# EAGLE design MIC_module (EAGLE 7.2.0)
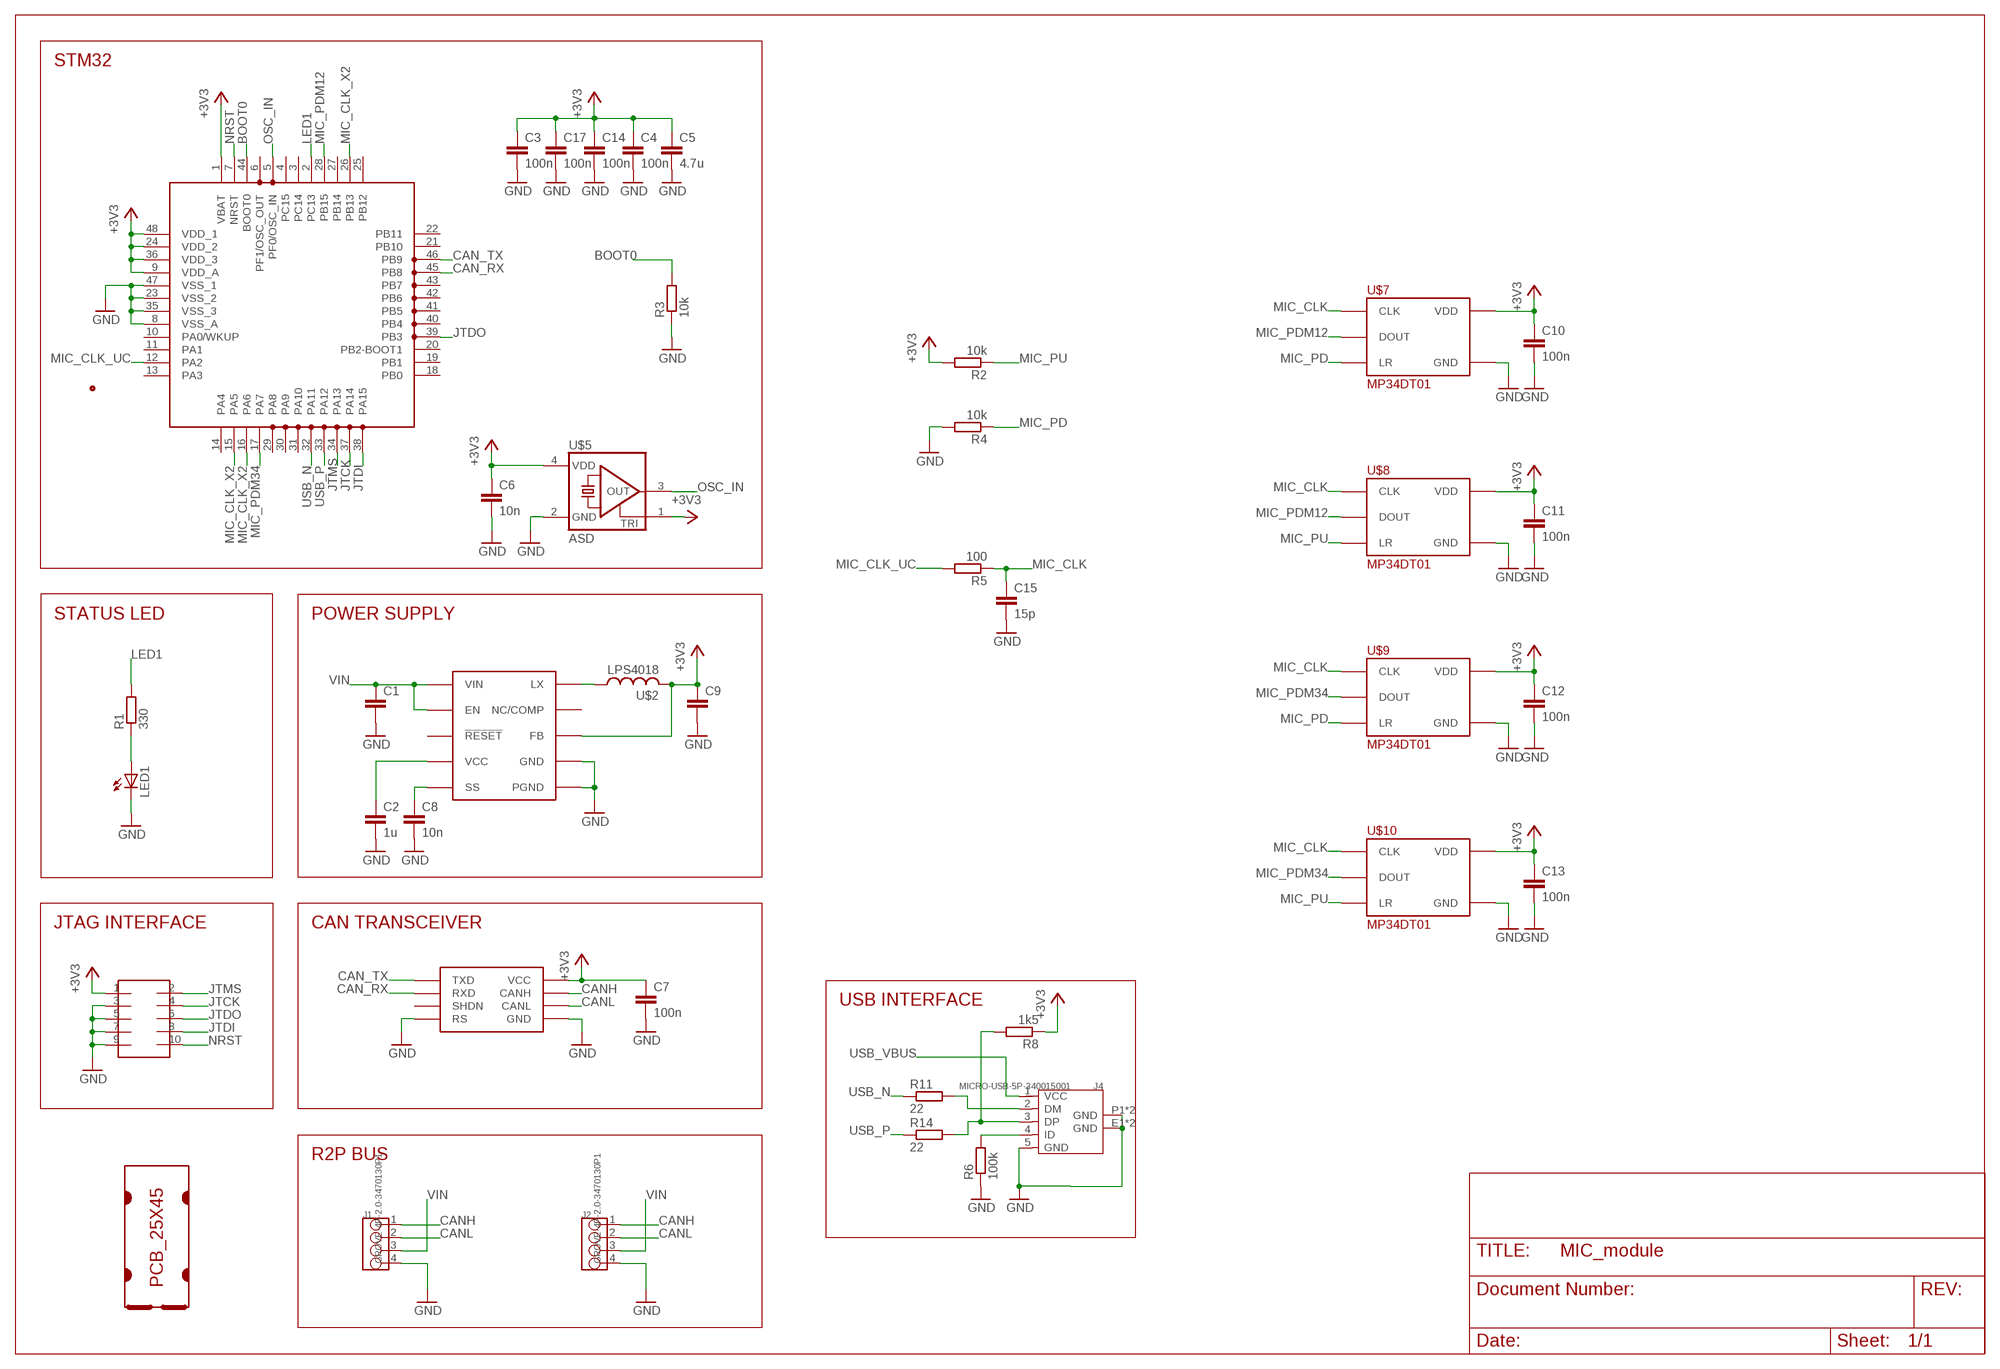
[diagram p0: schematic, sheet 1]

## Parts
C1  C-EUC1206  [C1206]
C2  1u  C-EUC0603  [C0603]
C3  100n  C-EUC0603  [C0603]
C4  100n  C-EUC0603  [C0603]
C5  4.7u  C-EUC0805  [C0805]
C6  10n  C-EUC0603  [C0603]
C7  100n  C-EUC0603  [C0603]
C8  10n  C-EUC0603  [C0603]
C9  C-EUC0805  [C0805]
C10  100n  C-EUC0603  [C0603]
C11  100n  C-EUC0603  [C0603]
C12  100n  C-EUC0603  [C0603]
C13  100n  C-EUC0603  [C0603]
C14  100n  C-EUC0603  [C0603]
C15  15p  C-EUC0603  [C0603]
C17  100n  C-EUC0603  [C0603]
J1  GROVE-4P-2.0-3470130P1  [4P-2.0]
J2  GROVE-4P-2.0-3470130P1  [4P-2.0]
J4  MICRO-USB-5P-340015001  [B-SMD-5P]
LED1  LEDCHIPLED_0805  [CHIPLED_0805]
R1  330  R-EU_R0603  [R0603]
R2  10k  R-EU_R0603  [R0603]
R3  10k  R-EU_R0603  [R0603]
R4  10k  R-EU_R0603  [R0603]
R5  100  R-EU_R0603  [R0603]
R6  100k  R-EU_R0603  [R0603]
R8  1k5  R-EU_R0603  [R0603]
R11  22  R-EU_R0603  [R0603]
R14  22  R-EU_R0603  [R0603]
SOT1  MAX3051EKA  [SOT23-8L]
U$1  PCB_25X45  [25X45]
U$2  LPS4018  [LPS4018]
U$3  MAX17501  [TDFN-10]
U$4  FTSH-105TH  [FTSH-105-TH]
U$5  ASD  [2.5X2]
U$6  STM32F303C  [LQFP48]
U$7  MP34DT01  [MP34DT01]
U$8  MP34DT01  [MP34DT01]
U$9  MP34DT01  [MP34DT01]
U$10  MP34DT01  [MP34DT01]

## Nets
+3V3: C3.1 C4.1 C5.1 C6.1 C7.1 C9.1 C10.1 C11.1 C12.1 C13.1 C14.1 C17.1 R2.2 R8.1 SOT1.3(VCC) U$2.P$2 U$3.P$5(FB) U$4.1 U$5.1(TRI) U$5.4(VDD) U$6.1(VBAT) U$6.9(VDD_A) U$6.24(VDD_2) U$6.36(VDD_3) U$6.48(VDD_1) U$7.P$1(VDD) U$8.P$1(VDD) U$9.P$1(VDD) U$10.P$1(VDD)
BOOT0: R3.2 U$6.44(BOOT0)
CAN_RX: SOT1.4(RXD) U$6.45(PB8)
CAN_TX: SOT1.1(TXD) U$6.46(PB9)
CANH: J1.1 J2.1 SOT1.7(CANH)
CANL: J1.2 J2.2 SOT1.6(CANL)
GND: C1.2 C2.2 C3.2 C4.2 C5.2 C6.2 C7.2 C8.2 C9.2 C10.2 C11.2 C12.2 C13.2 C14.2 C15.2 C17.2 J1.4 J2.4 J4.5(GND) J4.E1(GND) J4.E2(GND) J4.P1(GND) J4.P2(GND) LED1.C R3.1 R4.2 R6.1 SOT1.2(GND) SOT1.8(RS) U$3.P$1(PGND) U$3.P$9(GND) U$3.P$11(PGND) U$4.3 U$4.5 U$4.7 U$4.9 U$5.2(GND) U$6.8(VSS_A) U$6.23(VSS_2) U$6.35(VSS_3) U$6.47(VSS_1) U$7.P$5(GND) U$7.P$6(GND) U$7.P$7(GND) U$7.P$8(GND) U$8.P$5(GND) U$8.P$6(GND) U$8.P$7(GND) U$8.P$8(GND) U$9.P$5(GND) U$9.P$6(GND) U$9.P$7(GND) U$9.P$8(GND) U$10.P$5(GND) U$10.P$6(GND) U$10.P$7(GND) U$10.P$8(GND)
JTCK: U$4.4 U$6.37(PA14)
JTDI: U$4.8 U$6.38(PA15)
JTDO: U$4.6 U$6.39(PB3)
JTMS: U$4.2 U$6.34(PA13)
LED1: R1.2 U$6.2(PC13)
MIC_CLK: C15.1 R5.1 U$7.P$3(CLK) U$8.P$3(CLK) U$9.P$3(CLK) U$10.P$3(CLK)
MIC_CLK_UC: R5.2 U$6.12(PA2)
MIC_CLK_X2: U$6.15(PA5) U$6.16(PA6) U$6.26(PB13)
MIC_PD: R4.1 U$7.P$2(LR) U$9.P$2(LR)
MIC_PDM12: U$6.28(PB15) U$7.P$4(DOUT) U$8.P$4(DOUT)
MIC_PDM34: U$6.17(PA7) U$9.P$4(DOUT) U$10.P$4(DOUT)
MIC_PU: R2.1 U$8.P$2(LR) U$10.P$2(LR)
N$1: U$2.P$1 U$3.P$10(LX)
N$3: J4.2(DM) R11.2
N$4: LED1.A R1.1
N$5: J4.4(ID) R6.2
N$7: C2.1 U$3.P$4(VCC)
N$8: C8.1 U$3.P$6(SS)
N$32: J4.3(DP) R8.2 R14.2
NRST: U$4.10 U$6.7(NRST)
OSC_IN: U$5.3(OUT) U$6.5(PF0/OSC_IN)
USB_N: R11.1 U$6.32(PA11)
USB_P: R14.1 U$6.33(PA12)
USB_VBUS: J4.1(VCC)
VIN: C1.1 J1.3 J2.3 U$3.P$2(VIN) U$3.P$3(EN)
Unconnected: SOT1.5(SHDN) U$3.P$7(NC/COMP) U$3.P$8(!RESET) U$6.3(PC14) U$6.4(PC15) U$6.6(PF1/OSC_OUT) U$6.10(PA0/WKUP) U$6.11(PA1) U$6.13(PA3) U$6.14(PA4) U$6.18(PB0) U$6.19(PB1) U$6.20(PB2-BOOT1) U$6.21(PB10) U$6.22(PB11) U$6.25(PB12) U$6.27(PB14) U$6.29(PA8) U$6.30(PA9) U$6.31(PA10) U$6.40(PB4) U$6.41(PB5) U$6.42(PB6) U$6.43(PB7)

## Notes on the sheet
- STM32
- STATUS LED | POWER SUPPLY
- JTAG INTERFACE | CAN TRANSCEIVER
- USB INTERFACE
- R2P BUS

## Library data of the parts
C1-C15 C17 = rcl:C-EU: CAPACITOR, European symbol
J1 J2 = OPL Eagle Library:GROVE-4P-2.0
J4 = OPL Eagle Library:MICRO-USB-5P: ST-USB-001E：MICRO USB B SMD R/A
LED1 = led:LED: LED OSRAM: - CHIPLED LG R971, LG N971, LY N971, LG Q971, LY Q971, LO R971, LY R971 LH N974, LH R974 LS Q976, LO Q976, LY Q976 LO Q996 - Hyper CHIPLED LW Q18S LB Q993, LB Q99A, LB R99A - SideLED LS A670, LO A670, LY A670, LG A670, LP A670 LB A673, LV A673, LT A673, LW A673 LH A674 LY A675 LS A676, LA A676, LO A676, LY A676, LW A676 LS A679, LY A679, LG A679 - Hyper Micro SIDELED® LS Y876, LA Y876, LO Y876, LY Y876 LT Y87S - SmartLED LW L88C, LW L88S LB L89C, LB L89S, LG L890 LS L89K, LO L89K, LY L89K LS L896, LA L896, LO L896, LY L896 - TOPLED LS T670, LO T670, LY T670, LG T670, LP T670 LSG T670, LSP T670, LSY T670, LOP T670, LYG T670 LG T671, LOG T671, LSG T671 LB T673, LV T673, LT T673, LW T673 LH T674 LS T676, LA T676, LO T676, LY T676, LB T676, LH T676, LSB T676, LW T676 LB T67C, LV T67C, LT T67C, LS T67K, LO T67K, LY T67K, LW E67C LS E67B, LA E67B, LO E67B, LY E67B, LB E67C, LV E67C, LT E67C LW T67C LS T679, LY T679, LG T679 LS T770, LO T770, LY T770, LG T770, LP T770 LB T773, LV T773, LT T773, LW T773 LH T774 LS E675, LA E675, LY E675, LS T675 LS T776, LA T776, LO T776, LY T776, LB T776 LHGB T686 LT T68C, LB T68C - Hyper Mini TOPLED® LB M676 - Mini TOPLED Santana® LG M470 LS M47K, LO M47K, LY M47K Source: http://www.osram.convergy.de LUXEON: - LUMILED® LXK2-PW12-R00, LXK2-PW12-S00, LXK2-PW14-U00, LXK2-PW14-V00 LXK2-PM12-R00, LXK2-PM12-S00, LXK2-PM14-U00 LXK2-PE12-Q00, LXK2-PE12-R00, LXK2-PE12-S00, LXK2-PE14-T00, LXK2-PE14-U00 LXK2-PB12-K00, LXK2-PB12-L00, LXK2-PB12-M00, LXK2-PB14-N00, LXK2-PB14-P00, LXK2-PB14-Q00 LXK2-PR12-L00, LXK2-PR12-M00, LXK2-PR14-Q00, LXK2-PR14-R00 LXK2-PD12-Q00, LXK2-PD12-R00, LXK2-PD12-S00 LXK2-PH12-R00, LXK2-PH12-S00 LXK2-PL12-P00, LXK2-PL12-Q00, LXK2-PL12-R00 Source: www.luxeon.com KINGBRIGHT: KA-3528ASYC Source: www.kingbright.com
R1-R6 R8 R11 R14 = rcl:R-EU_: RESISTOR, European symbol
SOT1 = maxim:MAX3051
U$1 = r2p_pcb:PCB_25X45
U$2 = coilcraft:LPS4018
U$3 = maxim:MAX17501
U$4 = samtec:FTSH-105
U$5 = abracon:ASD
U$6 = st:STM32F303C
U$7-U$10 = st:MP34DT01

## Board
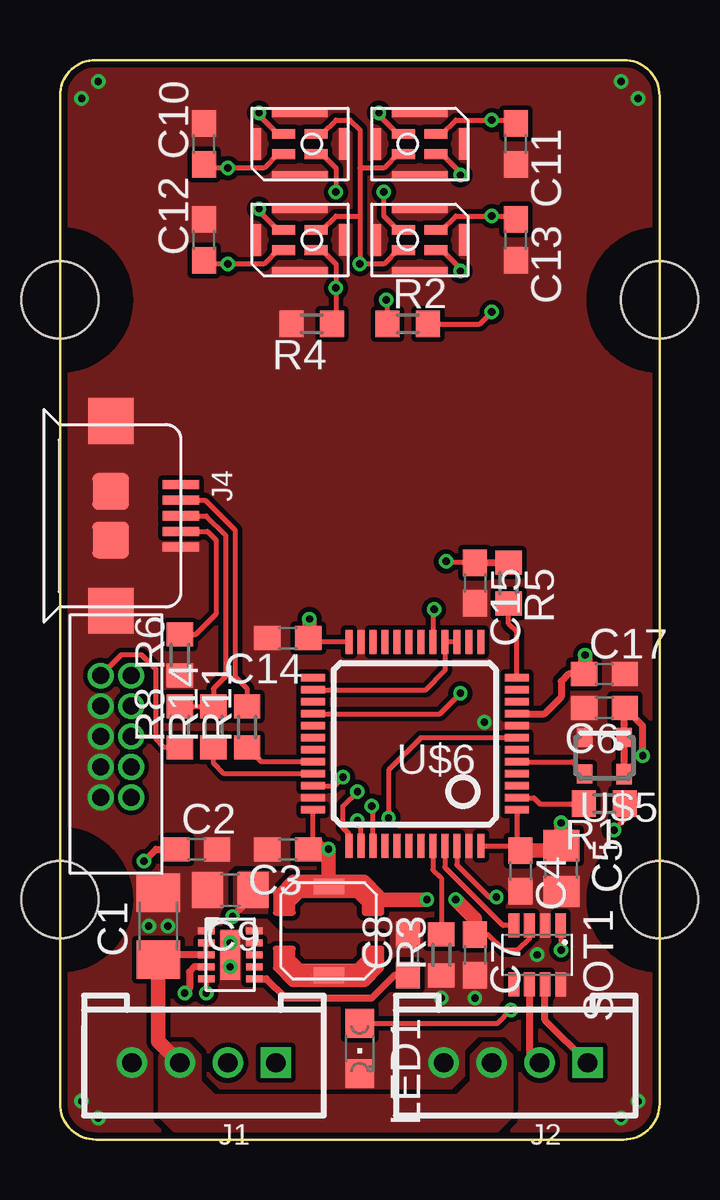
[diagram p1: board, top side]
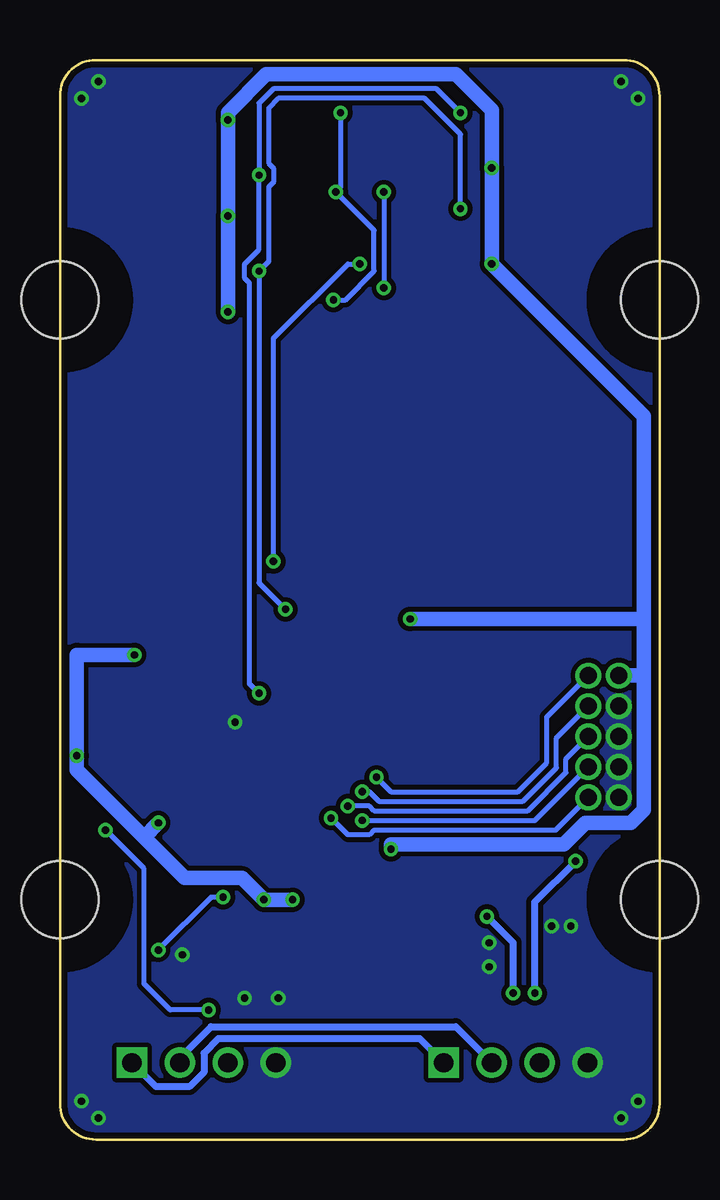
[diagram p2: board, bottom side, seen from below]

Size 25 x 45 mm. Coordinates in mm from the lower left corner, seen from the top.
Copper layers (1*16): Top 0.035mm / dielectric 1.5mm / Bottom 0.035mm
Design rules "test": minimum track width 0.2mm, minimum drill 0.3mm, track to track 0.2mm, track to pad 0.2mm, pad to pad 0.2mm, via to via 0.2mm, smd to smd 0mil, copper to edge 10mil, drill to drill 10mil, minimum pad ring 0.15mm, minimum via ring 0.15mm, stop-mask expansion 2mil, vias tented up to drill 100mil, thermal gap 10mil
tRestrict: 2 lines

### Footprints (pad centres in the part's own frame; a part is rotated, then mirrored left to right if it is on the bottom)
C1206 = smd 1.6 x 1.8: 1 -1.4,0; 2 1.4,0
C0603 = smd 1.1 x 1: 1 -0.85,0; 2 0.85,0
C0805 = smd 1.3 x 1.5: 1 -0.95,0; 2 0.95,0
4P-2.0 = drill 0.8 pad 1.27 square: 1 -3,0 | drill 0.8 pad 1.27: 2 -1,0; 3 1,0; 4 3,0
B-SMD-5P = smd 0.38 x 1.52: 1 -1.3,2.54; 2 -0.65,2.54; 3 0,2.54; 4 0.65,2.54; 5 1.3,2.54 | smd 1.524 x 1.524: E1 -1.016,-0.381; E2 1.016,-0.381 | smd 1.9 x 1.9: P1 -3.95,-0.381; P2 3.95,-0.381
CHIPLED_0805 = smd 1.2 x 1.2: A 0,-1.05; C 0,1.05
R0603 = smd 1 x 1.1: 1 -0.85,0; 2 0.85,0
SOT23-8L = smd 0.45 x 1: 1 -0.975,-1.225; 2 -0.325,-1.225; 3 0.325,-1.225; 4 0.975,-1.225; 5 0.975,1.225; 6 0.325,1.225; 7 -0.325,1.225; 8 -0.975,1.225
25X45 = hole 3.2: 0,10; 25,10; 0,35; 25,35
LPS4018 = smd 0.635 x 1.27: P$1 -1.85,0; P$2 1.85,0
TDFN-10 = smd 0.7 x 0.3: P$1 -1,1; P$2 -1,0.5; P$3 -1,0; P$4 -1,-0.5; P$5 -1,-1; P$6 1,-1; P$7 1,-0.5; P$8 1,0; P$9 1,0.5; P$10 1,1 | smd 0.8 x 2.08: P$11 0,0
FTSH-105-TH = drill 0.711 pad 1.016: 1 -2.54,0; 2 -2.54,1.27; 3 -1.27,0; 4 -1.27,1.27; 5 0,0; 6 0,1.27; 7 1.27,0; 8 1.27,1.27; 9 2.54,0; 10 2.54,1.27
2.5X2 = smd 0.65 x 0.8: 1 -0.825,-0.762; 2 0.825,-0.762; 3 0.825,0.762 | smd 0.65 x 0.85: 4 -0.825,0.762
LQFP48 = smd 1 x 0.3: 1 -4.25,2.75; 2 -4.25,2.25; 3 -4.25,1.75; 4 -4.25,1.25; 5 -4.25,0.75; 6 -4.25,0.25; 7 -4.25,-0.25; 8 -4.25,-0.75; 9 -4.25,-1.25; 10 -4.25,-1.75; 11 -4.25,-2.25; 12 -4.25,-2.75; 25 4.25,-2.75; 26 4.25,-2.25; 27 4.25,-1.75; 28 4.25,-1.25; 29 4.25,-0.75; 30 4.25,-0.25; 31 4.25,0.25; 32 4.25,0.75; 33 4.25,1.25; 34 4.25,1.75; 35 4.25,2.25; 36 4.25,2.75 | smd 0.3 x 1: 13 -2.75,-4.25; 14 -2.25,-4.25; 15 -1.75,-4.25; 16 -1.25,-4.25; 17 -0.75,-4.25; 18 -0.25,-4.25; 19 0.25,-4.25; 20 0.75,-4.25; 21 1.25,-4.25; 22 1.75,-4.25; 23 2.25,-4.25; 24 2.75,-4.25; 37 2.75,4.25; 38 2.25,4.25; 39 1.75,4.25; 40 1.25,4.25; 41 0.75,4.25; 42 0.25,4.25; 43 -0.25,4.25; 44 -0.75,4.25; 45 -1.25,4.25; 46 -1.75,4.25; 47 -2.25,4.25; 48 -2.75,4.25
MP34DT01 = smd 0.95 x 0.4: P$1 0.675,0.425; P$2 -0.675,0.425; P$3 -0.675,-0.425; P$4 0.675,-0.425 | smd 2.3 x 0.35: P$5 0,1.3; P$6 0,-1.3 | smd 0.35 x 1.3: P$7 -1.8,0; P$8 1.8,0

### Placement (x,y rotation side)
C1  4.1,8.9 90 top
C2  5.7,12.1 0 top
C3  9.5,12.1 180 top
C4  19.2,11.2 270 top
C5  20.9,11.3 270 top
C6  22.7,18 180 top
C7  17.3,7.7 270 top
C8  14.5,7.7 90 top
C9  7.1,10.4 180 top
C10  6,41.5 90 top
C11  19,41.5 270 top
C12  6,37.5 90 top
C13  19,37.5 270 top
C14  9.5,20.9 180 top
C15  17.3,23.2 270 top
C17  22.7,19.4 0 top
J1  6,3.2 180 top
J2  19,3.2 180 top
J4  2.5,26 270 top
LED1  12.5,3.8 180 top
R1  22.7,14 180 top
R2  14.5,34 0 top
R3  15.9,7.7 90 top
R4  10.5,34 180 top
R5  18.7,23.2 270 top
R6  5,20.2 90 top
R8  5,17.2 90 top
R11  7.8,17.2 90 top
R14  6.4,17.2 90 top
SOT1  19.9,7.7 180 top
U$1  0,0 0 top
U$2  11.2,8.7 90 top
U$3  7.1,7.7 0 top
U$4  1.7,16.8 270 top
U$5  22.7,16 180 top
U$6  14.8,16.5 180 top
U$7  10,41.5 180 top
U$8  15,41.5 0 top
U$9  10,37.5 180 top
U$10  15,37.5 0 top

### Tracks (layer width: path | path; a pad name or v marks a point on that pad's centre or on a via)
+3V3  (via drill 0.3)
  Top 0.2: U$3.P$5 v6.1,6.1 | C7.1 17.85,8.55 18.5,7.9 19.1,7.9 19.57,8.38 SOT1.3 | C3.1 10.55,12.3 U$6.36 | 19,12.25 C4.1 | U$6.1 19.05,12.2 C4.1 | 10.5,20.75 10.4,20.85 | U$6.48 19.2,12.25 C4.1 | U$6.24 10.35,20.75 C14.1 | U$7.P$1 9.07,41.08 8.5,40.5 v7,40.5 6.15,40.5 C10.1 | U$9.P$1 9.07,37.08 8.5,36.5 v7,36.5 6.15,36.5 C12.1 | U$10.P$1 15.93,37.92 16.5,38.5 v18,38.5 18.85,38.5 C13.1 | U$8.P$1 15.93,41.92 16.5,42.5 v18,42.5 18.85,42.5 C11.1 | R2.2 17.5,34 v18,34.5 | R8.1 4.35,16.35 4,16.7 4,19.6 3.4,20.2 2.56,20.2 U$4.1
  Top 0.3: 8.05,10.55 8.05,10.75 7.95,10.75 | U$6.9 20.2,17.75 20.9,18.45 20.9,19.1 21.2,19.4 C17.1 | v24.3,16 24.3,17.25 C6.1 23.52,17.98 U$5.1 U$5.4 | v7.2,9.3 8.05,10.15 C9.1
  Top 0.6: U$2.P$2 v11.2,12.1 C3.1 | 10.55,12.3 10.7,12.3 | C4.1 20.7,12.05 C5.1 v20.9,13.2 | C7.1 17.3,9.2 v16.5,10 | 21.8,19.45 C17.1 21.9,19.45 v21.9,20.2 | v15.3,10 13,10 | v10.4,21.7 10.4,20.85 C14.1
  Bottom 0.3: v6.1,6.1 6.1,8.2 v7.2,9.3
  Bottom 0.6: v15.3,10 v16.5,10 17.4,10.9 19.8,10.9 21.5,12.6 | v11.2,12.1 11.2,12.3 4,12.3 3.1,13.2 1.2,13.2 0.65,13.75 0.65,19.34 | v20.9,13.2 21.5,12.6 | 21.5,12.6 24.3,15.4 v24.3,16 24.3,20.2 v21.9,20.2 | 0.65,19.34 0.65,21.7 | 0.65,21.7 v10.4,21.7 | U$4.1 0.65,19.34 | 0.65,21.7 0.65,30.15 v7,36.5 v7,40.5 7,42.9 8.5,44.4 16.4,44.4 18,42.8 v18,42.5 v18,38.5 v18,34.5
  pour Top (rank 5, no thermals): 13.3,8.9 13.5,9.1 13.5,10.3 12.8,11 9.5,11 9.4,11.1 7.5,11.1 7.3,10.9 7.3,9.8 8.3,8.9
BOOT0
  Top 0.2: U$6.44 15.55,11.25 15.9,10.9 R3.2
CAN_RX
  Top 0.2: U$6.45 16.05,11.35 18.4,9 18.48,8.93 SOT1.4
CAN_TX  (via drill 0.3)
  Top 0.2: U$6.46 16.55,11.45 17.9,10.1 v18.2,10.1 | SOT1.1 20.88,7.92 v20.9,7.9
  Bottom 0.2: v18.2,10.1 18.7,10.1 v20.9,7.9
CANH
  Top 0.3: J2.1 20.23,4.97 SOT1.7
  Bottom 0.3: J1.1 10,4.2 18.4,4.2 19,3.6 19,2.8 19.6,2.2 21,2.2 J2.1
CANL
  Top 0.3: 19.57,3.62 J2.2 19.57,3.62 | SOT1.6 19.57,3.62
  Bottom 0.3: J1.2 8.5,4.7 18.7,4.7 20,3.4 J2.2
GND  (via drill 0.3)
  other vias: 7.1,8.2 7.1,7.2 4.5,8.9 3.7,8.9 15.9,5.9 17.3,5.9 19.9,7.7 24.1,1.6 23.4,0.9 1.6,0.9 0.9,1.6 17.7,17.4 1.6,44.1 0.9,43.4 23.4,44.1 24.1,43.4
  pour Bottom (no thermals): 0,0 25,0 25,45 0,45
  pour Top (rank 6, no thermals): 0,0 25,0 25,45 0,45
JTCK  (via drill 0.3)
  Top 0.2: U$6.37 12.05,12.75 11.8,13 11.8,13.9 v12.4,14.5
  Bottom 0.2: v12.4,14.5 12.1,14.5 11.7,14.1 5.7,14.1 4.3,15.5 4.3,16.74 U$4.4
JTDI  (via drill 0.3)
  Top 0.2: U$6.38 12.55,13.15 v12.4,13.3
  Bottom 0.2: v12.4,13.3 5.2,13.3 U$4.8
JTDO  (via drill 0.3)
  Top 0.2: U$6.39 13.05,13.85 v13,13.9
  Bottom 0.2: v13,13.9 12.1,13.9 11.9,13.7 5.5,13.7 3.9,15.3 3.9,15.87 U$4.6
JTMS  (via drill 0.3)
  Top 0.2: U$6.34 11.45,14.75 v11.8,15.1
  Bottom 0.2: v11.8,15.1 11.2,14.5 5.9,14.5 4.7,15.7 4.7,17.61 U$4.2
LED1
  Top 0.2: U$6.2 19.75,14.25 20,14 R1.2
MIC_CLK  (via drill 0.3)
  Top 0.2: U$7.P$3 10.93,41.92 11.5,42.5 12.1,42.5 12.5,42.1 12.5,40.5 | 12.5,40.5 12.5,38.5 | 12.5,38.5 v12.5,36.5 13.5,36.5 14.07,37.08 U$10.P$3 | U$8.P$3 14.07,41.08 13.5,40.5 12.5,40.5 | U$9.P$3 10.93,37.92 11.5,38.5 12.5,38.5 | C15.1 16.15,24.05 v16.1,24.1
  Top 0.3: C15.1 R5.1
  Bottom 0.2: v16.1,24.1 16.1,33.4 13,36.5 v12.5,36.5
MIC_CLK_UC
  Top 0.2: U$6.12 19.05,21.15 18.7,21.5 R5.2
MIC_CLK_X2
  Top 0.2: U$6.15 U$6.16 16.05,19.55 15.25,18.75 U$6.26
MIC_PD  (via drill 0.3)
  Top 0.2: U$9.P$2 10.93,37.08 11.5,36.5 v11.5,35.5 11.5,34.15 R4.1 | U$7.P$2 10.93,41.08 11.5,40.5 v11.5,39.5
  Bottom 0.2: v11.5,39.5 v11.5,35.5
MIC_PDM12  (via drill 0.3)
  Top 0.2: U$7.P$4 9.07,41.92 8.3,42.7 v8.3,42.8 | U$8.P$4 15.93,41.08 16.7,40.3 v16.7,40.2 | U$6.28 15.85,17.75 v16.7,18.6
  Bottom 0.2: v8.3,42.8 9.3,43.8 16.1,43.8 16.7,43.2 v16.7,40.2 16.7,37.1 17.3,36.5 17.3,35.9 17.1,35.7 17.1,19 v16.7,18.6
MIC_PDM34  (via drill 0.3)
  Top 0.2: U$9.P$4 9.07,37.92 8.3,38.7 v8.3,38.8 | U$10.P$4 15.93,37.08 16.7,36.3 v16.7,36.2 | v15.6,22.1 15.55,22.05 U$6.17
  Bottom 0.2: v15.6,22.1 16.7,23.2 v16.7,36.2 16.3,36.6 16.3,39.7 16.1,39.9 16.1,40.5 16.3,40.7 16.3,43 15.9,43.4 9.8,43.4 8.3,41.9 v8.3,38.8
MIC_PU  (via drill 0.3)
  Top 0.2: U$10.P$2 14.07,37.92 13.5,38.5 v13.5,39.5 | U$8.P$2 14.07,41.92 13.3,42.7 v13.3,42.8 | R2.1 13.65,34.95 v13.6,35
  Bottom 0.2: v13.3,42.8 13.3,39.7 v13.5,39.5 11.9,37.9 11.9,36.2 13.1,35 v13.6,35
N$1
  pour Top (no thermals): 7.8,8.7 8.2,8.7 8.5,8.2 8.5,7.5 9.6,6.4 12.8,6.4 13.5,7.1 13.5,8.3 13.3,8.5 9.2,8.5 8.6,9.1 7.8,9.1
N$3
  Top 0.2: J4.2 6.05,26.65 7.3,25.4 7.3,19.3 7.8,18.8 R11.2
N$4  (via drill 0.3)
  Top 0.2: R1.1 23.55,13.35 v23.1,12.9 | v18.8,5.4 18.25,4.85 LED1.A
  Bottom 0.2: v18.8,5.4 20.4,5.4 21.5,6.5 21.5,11.3 v23.1,12.9
N$5
  Top 0.2: R6.2 5.65,21.05 6.5,21.9 6.5,25 6.15,25.35 J4.4
N$7  (via drill 0.3)
  Top 0.3: U$3.P$4 5.6,7.2 5.4,7 5.4,6.3 v5.2,6.1 | v3.5,11.6 4,12.1 C2.1
  Bottom 0.3: v5.2,6.1 5.2,9.9 v3.5,11.6
N$8
  Top 0.3: U$3.P$6 8.6,6.7 9.4,5.9 13,5.9 13.95,6.85 C8.1
N$32
  Top 0.2: J4.3 6.1,26 6.9,25.2 6.9,19.3 6.4,18.8 R14.2 R8.2
NRST  (via drill 0.3)
  Top 0.2: U$6.7 15.05,16.75 13.7,15.4 v13.7,13.4
  Bottom 0.2: v13.7,13.4 13,12.7 12.7,12.7 12.1,12.7 11.9,12.9 4.33,12.9 U$4.10
OSC_IN
  Top 0.2: U$6.5 21.36,15.75 U$5.3
USB_N
  Top 0.2: U$6.32 8.4,15.75 R11.1
USB_P
  Top 0.2: U$6.33 6.85,15.25 6.4,15.7 R14.1
VIN
  Top 0.2: U$3.P$3 U$3.P$2
  Top 0.3: U$3.P$3 4.3,7.7 C1.1
  Top 0.6: C1.1 4.1,4.1 J1.3
  pour Top (no thermals): 4.7,4 5.3,4 5.8,3.5 5.8,2.4 6.4,1.8 16.6,1.8 17.2,2.4 17.2,3.5 17.7,4 18.3,4 18.8,3.5 18.8,1 17.8,0 5.2,0 4.2,1 4.2,3.5